# Altium schematic sheet IO_CTRL.SchDoc: FMC DAC 1.5GS 4CH
size 420 x 297 mm; Author: G.Kasprowicz; CompanyName: WUT ISE; DrawnBy: G.Kasprowicz; Organization: WUT ISE; Address1: PW ISE; Address2: Nowowiejska 15/19 00-665 Warsaw; Address3: gkasprow@gmail.com; DocumentNumber: 8; Revision: 1; SheetNumber: 8; SheetTotal: 12; ModifiedBy: -; CheckedDate: -; Title2: IO CTRL; DivGrp: WUT ISE; Designer: G.Kasprowicz; ModifiedDate: -; ProjectName: Sensor Box
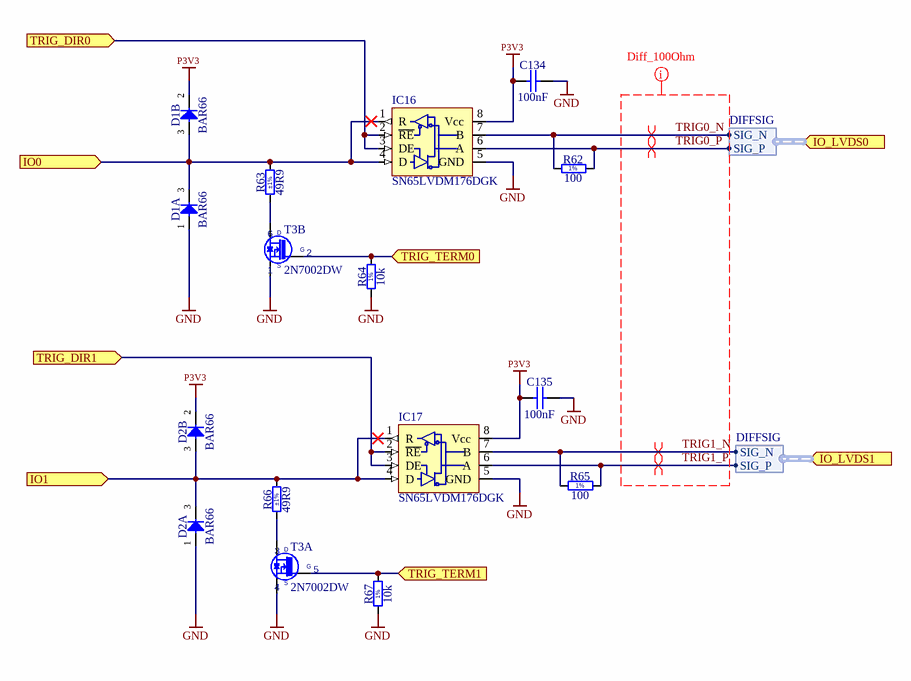
[diagram p0: IO_CTRL.SchDoc]

## Parts
C134  100nF  [CAPC1005X55N]
C135  100nF  [CAPC1005X55N]
D1  BAR66  [SOT95P240X110-3N]  (parts A,B of 2)
D2  BAR66  [SOT95P240X110-3N]  (parts A,B of 2)
IC16  SN65LVDM176DGK  [MSOP8 TI/AD]
IC17  SN65LVDM176DGK  [MSOP8 TI/AD]
R62  100  [RESC0603X28N]
R63  49R9  Tolerance: ±1%  [RESC3225X70N]
R64  10k  [RESC1005X40N]
R65  100  [RESC0603X28N]
R66  49R9  Tolerance: ±1%  [RESC3225X70N]
R67  10k  [RESC1005X40N]
T3  2N7002DW  [SOT65P210X110-6N]  (parts A,B of 2)

## Ports
IO0 (in), IO1 (in), IO_LVDS0 (in, harness DIFFSIG), IO_LVDS1 (in, harness DIFFSIG), TRIG_DIR0 (in), TRIG_DIR1 (in), TRIG_TERM0 (in), TRIG_TERM1 (in)

## Harnesses
DIFFSIG: SIG_N, SIG_P

## Nets
GND: C134.2 C135.2 D1.1(A) D2.1(A) IC16.5(GND) IC17.5(GND) R64.1 R67.1 T3.1(S2) T3.4(S1)
P3V3: C134.1 C135.1 D1.2(C) D2.2(C) IC16.8(Vcc) IC17.8(Vcc)
IO0: D1.3(COMAC) IC16.1(R) IC16.4(D) R63.2 ; port IO0
IO1: D2.3(COMAC) IC17.1(R) IC17.4(D) R66.2 ; port IO1
TRIG0_N: IC16.7(B) R62.1 ; port IO_LVDS0.SIG_N
TRIG0_P: IC16.6(A) R62.2 ; port IO_LVDS0.SIG_P
TRIG1_N: IC17.7(B) R65.1 ; port IO_LVDS1.SIG_N
TRIG1_P: IC17.6(A) R65.2 ; port IO_LVDS1.SIG_P
TRIG_DIR0: IC16.2(~{RE}) IC16.3(DE) ; port TRIG_DIR0
TRIG_DIR1: IC17.2(~{RE}) IC17.3(DE) ; port TRIG_DIR1
TRIG_TERM0: R64.2 T3.2(G2) ; port TRIG_TERM0
TRIG_TERM1: R67.2 T3.5(G1) ; port TRIG_TERM1
NetR63_1: R63.1 T3.6(D2)
NetR66_1: R66.1 T3.3(D1)

## Layout directives
differential pair: TRIG0_N, TRIG0_P, TRIG1_N, TRIG1_P
net class Diff_100Ohm: TRIG0_N, TRIG0_P, TRIG1_N, TRIG1_P

## Notes on the sheet
- Project/Equipment
- Document
- Designer
- Drawn by
- Check.by
- Copyright WUT ISE 2018.
  This documentation describes Open Hardware and is licensed under the CERN OHL v.1.1. You may redistribute and modify this documentation under the terms of the CERN OHL v.1.1. (http://ohwr.org/CERNOHL). This documentation is distributed WITHOUT ANY EXPRESS OR IMPLIED WARRANTY, INCLUDING OF MERCHANTABILITY, SATISFACTORY QUALITY AND FITNESS FOR A PARTICULAR PURPOSE. Please see the CERN OHL v.1.1 for applicable conditions.
- Contact
- File
- Last Mod.
- Print Date
- Sheet
- Size
- A3
- of
- Rev
- (in symbol 2N7002DW, part A) D; G; S
- (in symbol 2N7002DW, part B) D; G; S
- (in symbol R0201_100R_1%_0.05W_200PPM) 1%
- (in symbol R0402_10K_1%_0.0625W_100PPM) 1%

## Library data of the parts
C134 C135 = CC0402_100NF_16V_10%_X5R: Non-polarised capacitor; Part Description: SMD Multilayer Chip Ceramic Capacitor; Manufacturer: GENERIC; Manufacturer1 Part Number: GRM155R61C104KA88D; Voltage: 16V; TC: X5R; Tolerance: ±10%; Part Number: CC0402_100NF_16V_10%_X5R; Component Kind: Standard; Component Type: Standard; Pin Count: 2; Value: 100nF; Status: None; Manufacturer Part Number: CC0402_100NF_16V_10%_X5R; Case: 0402; Mounted: Yes; Socket: No; SMD: Yes; Sense: No; Manufacturer1 Example: MURATA; Manufacturer1 ComponentHeight: 0.55mm; HelpURL: \\cern.ch\dfs\Applications\Altium\Datasheets\CC0402_X5R_MURATA_GRM.pdf; Author: CERN DEM JLC; CreateDate: 10.12.2013; LatestRevisionDate: 10.12.2013
D1 D2 = BAR66: Serial Diode; Part Description: Silicon PIN Diode Array (Series Connected); Manufacturer: INFINEON; Voltage: 150V; Power: 250mA; Table: Diodes; Part Number: BAR66; Component Kind: Standard; Component Type: Standard; Device: BAR66; PackageDescription: SOT23 3-Leads, Pitch 0.95mm - Body 1.3x2.9mm, IPC Medium Density; Manufacturer Part Number: BAR66; Pin Count: 3; Case: SOT23; Mounted: Yes; Socket: No; SMD: Yes; ComponentHeight: 1.1mm; HelpURL: \\cern.ch\dfs\Applications\Altium\Datasheets\BAR66.pdf; Author: CERN DEM JLC; CreateDate: 18/1/2010; LatestRevisionDate: 5/10/2010
IC16 IC17 = SN65LVDM176: High Speed Differential Transceiver LVDS/LVTTL; ComponentLink1Description: Datasheet; ComponentLink1URL: C:\TSR\Laurin\Projects\FMC\CERN DAC\Parts\Digital\SN65LVDM176.pdf
R62 R65 = R0201_100R_1%_0.05W_200PPM: Resistor - 1%; Part Description: Thick Film Chip Resistor; Manufacturer: GENERIC; Manufacturer1 Part Number: CRCW0201100RFNED; Power: 0.05W; TC: ±200ppm/°C; PressFit: No; Part Number: R0201_100R_1%_0.05W_200PPM; Component Kind: Standard; Component Type: Standard; Pin Count: 2; Value: 100; Status: Not Recommended; Tolerance: ±1%; Manufacturer Part Number: R0201_100R_1%_0.05W_200PPM; Case: 0201; Mounted: Yes; Socket: No; SMD: Yes; Manufacturer1 Example: VISHAY; Manufacturer1 ComponentHeight: 0.27mm; HelpURL: \\cern.ch\dfs\Applications\Altium\Datasheets\R0201_VISHAY_CRCW0201 e3.pdf; Author: CERN DEM JLC; CreateDate: 13.11.2014; LatestRevisionDate: 13.11.2014; Sense: No
R63 R66 = R1210_49R9_1%_0.5W_100PPM_VISHAY_CRCW: Resistor - 1%; Part Description: Thick Film Chip Resistor; Manufacturer: VISHAY DRALORIC; Manufacturer Part Number: CRCW121049R9FK; Power: 0.5W; TC: ±100ppm/°C; PressFit: No; Part Number: R1210_49R9_1%_0.5W_100PPM_VISHAY_CRCW; Component Kind: Standard; Component Type: Standard; Pin Count: 2; Value: 49R9; Status: None; Case: 1210; Mounted: Yes; Sense: No; Socket: No; SMD: Yes; ComponentHeight: 0.7mm; HelpURL: \\cern.ch\dfs\Applications\Altium\Datasheets\R1210_VISHAY_CRCW1210.pdf; Author: CERN DEM JMW; CreateDate: 06.08.2014; LatestRevisionDate: 06.08.2014
R64 R67 = R0402_10K_1%_0.0625W_100PPM: Resistor - 1%; Part Description: General Purpose Thick Film Chip Resistor; Manufacturer: GENERIC; Manufacturer1 Part Number: 232270671003L; TC: ±100ppm/°C; Table: Resistors SMD; Part Number: R0402_10K_1%_0.0625W_100PPM; Component Kind: Standard; Component Type: Standard; Pin Count: 2; Value: 10k; Status: Not recommended; Power: 0.0625W; Tolerance: ±1%; Manufacturer Part Number: R0402_10K_1%_0.0625W_100PPM; Case: 0402; Mounted: Yes; Socket: No; SMD: Yes; Manufacturer1 Example: YAGEO PHYCOMP; Manufacturer1 ComponentHeight: 0.4mm; HelpURL: \\cern.ch\dfs\Applications\Altium\Datasheets\R0402_Phycomp_RC0402.pdf; Author: CERN DEM JLC; CreateDate: 3/12/2007; LatestRevisionDate: 17/10/2012
T3 = 2N7002DW: 60 V, 115 mA, Dual N-Channel Field Effect Transistor, Enhancement Mode; Part Description: 60V 115mA Dual N-Channel Field Effect Transistor, Enhancement Mode; Manufacturer: ON SEMICONDUCTOR; PressFit: No; Bonding: No; Part Number: 2N7002DW; Component Kind: Standard; Component Type: Standard; Device: 2N7002DW; PackageDescription: SOT363, SC70-6, 0.65mm Pitch; 6 Pin, 1.25mm W X 2.00mm L X 1.10mm H body, IPC Medium Density; Manufacturer Part Number: 2N7002DW; Pin Count: 6; Case: SOT363; Mounted: Yes; Socket: No; SMD: Yes; Sense: No; ComponentHeight: 1.1mm; HelpURL: \\cern.ch\dfs\Applications\Altium\Datasheets\2N7002DW.pdf; Author: CERN DEM BC; CreateDate: 25.11.2020; LatestRevisionDate: 25.11.2020